# EAGLE schematic NinjaPCB_ver2-180115 (EAGLE 6.6.0)
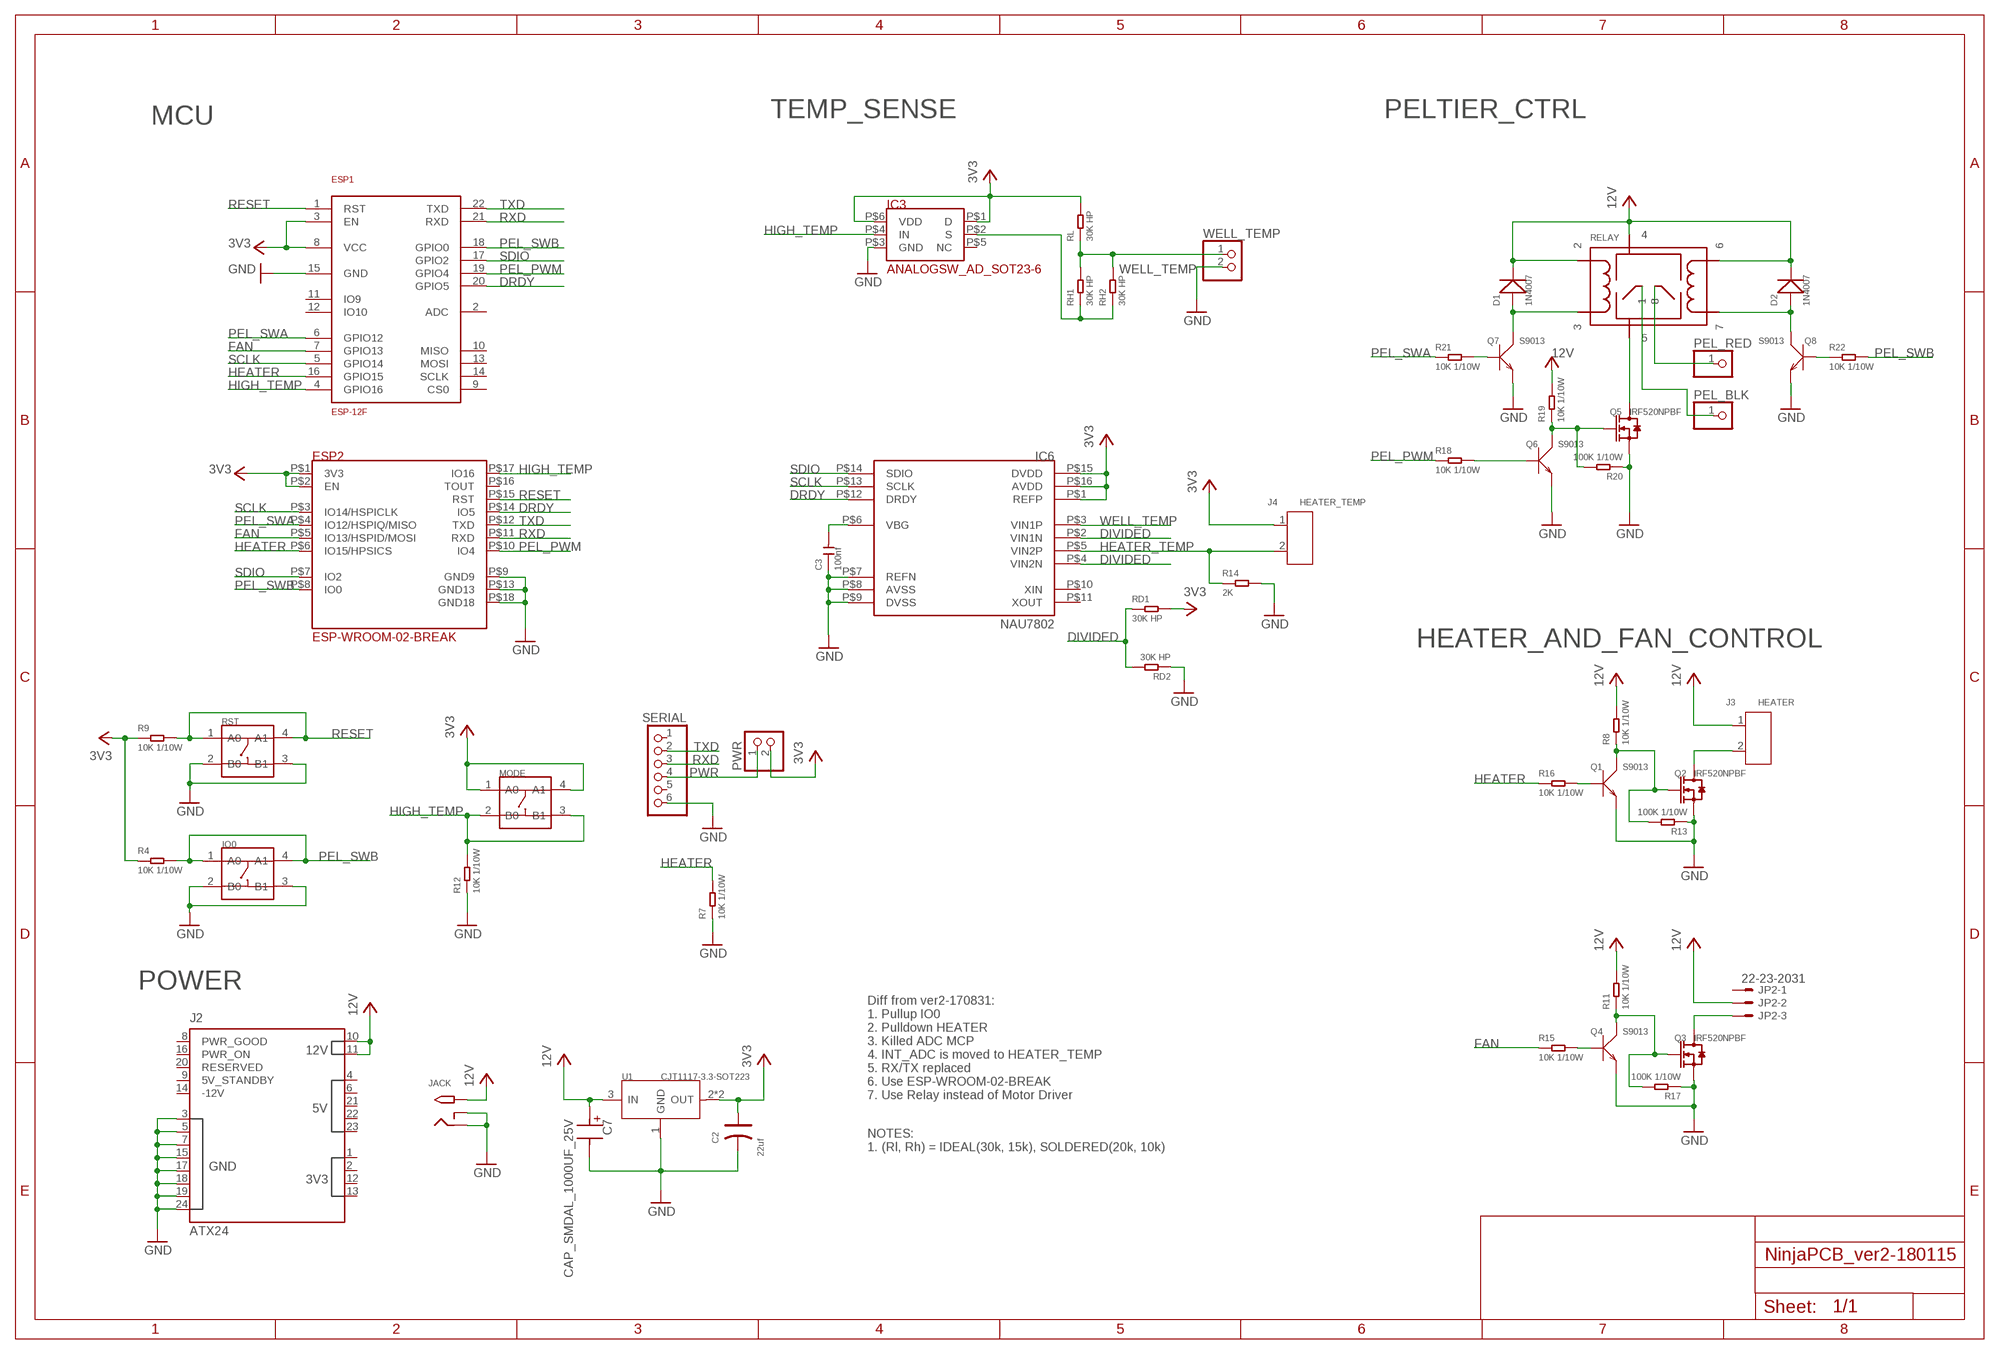
[diagram p0: schematic, sheet 1]

## Parts
C2  22uf  TANTALUM-SMD-22UF-16V(AVX-B)  [AVX-B]
C3  100nf  CERAMIC-100NF-50V-10%-X7R(0603)  [C0603]
C7  CAP_SMDAL_1000UF_25V  [CAP_SMD_AL_D125]
D1  1N4007  DIODE-GEN-PURPOSE-1KV-1A(DO-214AC)  [DO-214AC]
D2  1N4007  DIODE-GEN-PURPOSE-1KV-1A(DO-214AC)  [DO-214AC]
ESP1  ESP-12F  [ESP-12F]
ESP2  ESP-WROOM-02-BREAK  [ESP-WROOM-02-BREAK]
IC3  ANALOGSW_AD_SOT23-6  [SOT-23-6]
IC6  NAU7802  [SOP-16]
IO0  DIP-SWITCH-TACTILE-SPST-NO/TS-1109(4P-D6.0MM)'TS-1109'  [SW4-6.0X6.0X5.0MM]
J2  ATX24  [ATX24]
J3  HEATER  SCREW-TERMINAL-GREEN(2P-3.5)  [H2-3.5-7.0X7.0MM]
J4  HEATER_TEMP  SCREW-TERMINAL-GREEN(2P-3.5)  [H2-3.5-7.0X7.0MM]
JACK  2.1MMJACKTHM  [PJ-102A]
JP2  22-23-2031  [22-23-2031]
MODE  DIP-SWITCH-TACTILE-SPST-NO/TS-1109(4P-D6.0MM)'TS-1109'  [SW4-6.0X6.0X5.0MM]
PEL_BLK  PINHD-1X1L  [1X01LONG]
PEL_RED  PINHD-1X1L  [1X01LONG]
PWR  PINHD-1X2  [1X02]
Q1  S9013  SMD-TRANSISTORS-NPN-25V-500MA-S9013(SOT-23)  [SOT-23]
Q2  IRF520NPBF  DIP-MOSFET-N-CH-100V-9.7A-IRF520NPBF(TO-220AB)CORRECT  [TO-220]
Q3  IRF520NPBF  DIP-MOSFET-N-CH-100V-9.7A-IRF520NPBF(TO-220AB)CORRECT  [TO-220]
Q4  S9013  SMD-TRANSISTORS-NPN-25V-500MA-S9013(SOT-23)  [SOT-23]
Q5  IRF520NPBF  DIP-MOSFET-N-CH-100V-9.7A-IRF520NPBF(TO-220AB)CORRECT  [TO-220]
Q6  S9013  SMD-TRANSISTORS-NPN-25V-500MA-S9013(SOT-23)  [SOT-23]
Q7  S9013  SMD-TRANSISTORS-NPN-25V-500MA-S9013(SOT-23)  [SOT-23]
Q8  S9013  SMD-TRANSISTORS-NPN-25V-500MA-S9013(SOT-23)  [SOT-23]
R4  10K 1/10W  SMD-RES-10K-5%-1/10W(0603)  [R0603]
R7  10K 1/10W  SMD-RES-10K-5%-1/10W(0603)  [R0603]
R8  10K 1/10W  SMD-RES-10K-5%-1/10W(0603)  [R0603]
R9  10K 1/10W  SMD-RES-10K-5%-1/10W(0603)  [R0603]
R11  10K 1/10W  SMD-RES-10K-5%-1/10W(0603)  [R0603]
R12  10K 1/10W  SMD-RES-10K-5%-1/10W(0603)  [R0603]
R13  100K 1/10W  SMD-RES-100K-5%-1/10W(0603)  [R0603]
R14  2K  SMD-RES-2K-1%-1/10W(0603)  [R0603]
R15  10K 1/10W  SMD-RES-10K-5%-1/10W(0603)  [R0603]
R16  10K 1/10W  SMD-RES-10K-5%-1/10W(0603)  [R0603]
R17  100K 1/10W  SMD-RES-100K-5%-1/10W(0603)  [R0603]
R18  10K 1/10W  SMD-RES-10K-5%-1/10W(0603)  [R0603]
R19  10K 1/10W  SMD-RES-10K-5%-1/10W(0603)  [R0603]
R20  100K 1/10W  SMD-RES-100K-5%-1/10W(0603)  [R0603]
R21  10K 1/10W  SMD-RES-10K-5%-1/10W(0603)  [R0603]
R22  10K 1/10W  SMD-RES-10K-5%-1/10W(0603)  [R0603]
RD1  30K HP  R0603  [R0603]
RD2  30K HP  R0603  [R0603]
RELAY  NEC-RELAY2ET2  [NEC-ET2-N8]
RH1  30K HP  R0603  [R0603]
RH2  30K HP  R0603  [R0603]
RL  30K HP  R0603  [R0603]
RST  DIP-SWITCH-TACTILE-SPST-NO/TS-1109(4P-D6.0MM)'TS-1109'  [SW4-6.0X6.0X5.0MM]
SERIAL  PINHD-1X6  [1X06]
U1  CJT1117-3.3-SOT223  PMIC-CJT1117-3.3(SOT223)  [SOT-223]
WELL_TEMP  PINHD-1X2  [1X02]

## Nets
3V3: C2.+ ESP1.3(EN) ESP1.8(VCC) ESP2.P$1(3V3) ESP2.P$2(EN) IC3.P$1(D) IC3.P$6(VDD) IC6.P$1(REFP) IC6.P$15(DVDD) IC6.P$16(AVDD) J4.1 MODE.1(A0) MODE.4(A1) PWR.2 R4.1 R9.1 RD1.2 RL.2 U1.2(OUT) U1.TER(OUT)
12V: C7.P$P D1.2(-) D2.2(-) J2.10(12V_10) J2.11(12V_11) J3.1 JACK.TIP JP2.2 R8.2 R11.2 R19.2 RELAY.P$2 RELAY.P$4 RELAY.P$6 U1.3(IN)
DIVIDED: IC6.P$2(VIN1N) IC6.P$4(VIN2N) RD1.1 RD2.2
DRDY: ESP1.20(GPIO5) ESP2.P$14(IO5) IC6.P$12(DRDY)
FAN: ESP1.7(GPIO13) ESP2.P$5(IO13/HSPID/MOSI) R15.1
GND: C2.- C3.1 C7.P$M ESP1.15(GND) ESP2.P$9(GND9) ESP2.P$13(GND13) ESP2.P$18(GND18) IC3.P$3(GND) IC6.P$7(REFN) IC6.P$8(AVSS) IC6.P$9(DVSS) IO0.2(B0) IO0.3(B1) J2.3(GND3) J2.5(GND5) J2.7(GND7) J2.15(GND15) J2.17(GND17) J2.18(GND18) J2.19(GND19) J2.24(GND24) JACK.RING JACK.RING_SW Q1.2(E) Q2.3(S) Q3.3(S) Q4.2(E) Q5.3(S) Q6.2(E) Q7.2(E) Q8.2(E) R7.1 R12.1 R13.1 R14.2 R17.1 R20.1 RD2.1 RST.2(B0) RST.3(B1) SERIAL.6 U1.1(GND) WELL_TEMP.2
HEATER: ESP1.16(GPIO15) ESP2.P$6(IO15/HPSICS) R7.2 R16.1
HEATER_TEMP: IC6.P$5(VIN2P) J4.2 R14.1
HIGH_TEMP: ESP1.4(GPIO16) ESP2.P$17(IO16) IC3.P$4(IN) MODE.2(B0) MODE.3(B1) R12.2
N$2: J3.2 Q2.2(D) Q2.HEAT(D)
N$3: Q5.2(D) Q5.HEAT(D) RELAY.P$5
N$4: JP2.3 Q3.2(D) Q3.HEAT(D)
N$5: Q5.1(G) Q6.3(C) R19.1 R20.2
N$6: PEL_RED.1 RELAY.P$8
N$7: PEL_BLK.1 RELAY.P$1
N$25: Q3.1(G) Q4.3(C) R11.1 R17.2
N$27: IC3.P$2(S) RH1.1 RH2.1
N$29: Q1.3(C) Q2.1(G) R8.1 R13.2
N$30: Q6.1(B) R18.2
N$31: Q4.1(B) R15.2
N$32: Q1.1(B) R16.2
N$33: D1.1(+) Q7.3(C) RELAY.P$3
N$34: Q7.1(B) R21.2
N$35: Q8.1(B) R22.1
N$36: D2.1(+) Q8.3(C) RELAY.P$7
N$92: C3.2 IC6.P$6(VBG)
PEL_PWM: ESP1.19(GPIO4) ESP2.P$10(IO4) R18.1
PEL_SWA: ESP1.6(GPIO12) ESP2.P$4(IO12/HSPIQ/MISO) R21.1
PEL_SWB: ESP1.18(GPIO0) ESP2.P$8(IO0) IO0.1(A0) IO0.4(A1) R4.2 R22.2
PWR: PWR.1 SERIAL.4
RESET: ESP1.1(RST) ESP2.P$15(RST) R9.2 RST.1(A0) RST.4(A1)
RXD: ESP1.21(RXD) ESP2.P$11(RXD) SERIAL.3
SCLK: ESP1.5(GPIO14) ESP2.P$3(IO14/HSPICLK) IC6.P$13(SCLK)
SDIO: ESP1.17(GPIO2) ESP2.P$7(IO2) IC6.P$14(SDIO)
TXD: ESP1.22(TXD) ESP2.P$12(TXD) SERIAL.2
WELL_TEMP: IC6.P$3(VIN1P) RH1.2 RH2.2 RL.1 WELL_TEMP.1
Unconnected: ESP1.2(ADC) ESP1.9(CS0) ESP1.10(MISO) ESP1.11(IO9) ESP1.12(IO10) ESP1.13(MOSI) ESP1.14(SCLK) ESP2.P$16(TOUT) IC3.P$5(NC) IC6.P$10(XIN) IC6.P$11(XOUT) J2.1(3V3_1) J2.2(3V3_2) J2.4(5V_4) J2.6(5V_6) J2.8(PWR_GOOD) J2.9(5V_STANDBY) J2.12(3V3_12) J2.13(3V3_13) J2.14(-12V) J2.16(PWR_ON) J2.20(RESERVED) J2.21(5V_21) J2.22(5V_22) J2.23(5V_23) JP2.1 SERIAL.1 SERIAL.5

## Notes on the sheet
- MCU | TEMP_SENSE | PELTIER_CTRL
- HEATER_AND_FAN_CONTROL
- POWER
- Diff from ver2-170831: 
  1. Pullup IO0
  2. Pulldown HEATER
  3. Killed ADC MCP
  4. INT_ADC is moved to HEATER_TEMP
  5. RX/TX replaced
  6. Use ESP-WROOM-02-BREAK
  7. Use Relay instead of Motor Driver
- NOTES: 
  1. (Rl, Rh) = IDEAL(30k, 15k), SOLDERED(20k, 10k)

## Library data of the parts
C2 = Seeed-Capacitor:TANTALUM-SMD-22UF-16V(AVX-B): 302020013; MPN: TAJB226*016#NJ
C3 = Seeed-Capacitor:CERAMIC-100NF-50V-10%-X7R(0603): 302010138; MPN: CC0603KRX7R9BB104
C7 = Seeed-OPL-2017-01-Capacitor-akita:CAP_SMDAL_1000UF_25V: SMD CAP Aluminum 1000uF-25V;D12.5*H13.5mm SKU: 302030098
D1 D2 = Seeed-Diode:DIODE-GEN-PURPOSE-1KV-1A(DO-214AC): 304010013; MPN: 1N4007
ESP1 = Seeed-OPL-2017-01-Sensor-camilo:ESP-12F: 317060163
ESP2 = PCR-Module:ESP-WROOM-02-BREAK
IC3 = PCR-IC:ANALOGSW_AD_SOT23-6
IC6 = PCR-IC:NAU7802
IO0 MODE RST = Seeed-Switch:DIP-SWITCH-TACTILE-SPST-NO/TS-1109(4P-D6.0MM): 311020024
J2 = PCR-Connector:ATX24
J3 J4 = Seeed-Connector:SCREW-TERMINAL-GREEN(2P-3.5): 320110028; VALUE: GREEN-2P-3.5
JACK = adafruit:2.1MMJACK: 2.1mm x 5.5mm THM DC jack with internal switch. Digikey part #PJ-102A, 4UCON part #05537 2.1mm x 5.5mm SMT DC jack with internal switch. Digikey part #PJ-002A-SMT, 4UCON part #03267 By microbuilder.eu & adafruit.com
JP2 = con-molex:22-23-2031: .100" (2.54mm) Center Header - 3 Pin; MF: MOLEX; MPN: 22-23-2031; OC_FARNELL: 1462950; OC_NEWARK: 30C0862
PEL_BLK PEL_RED = pinhead:PINHD-1X1: PIN HEADER
PWR WELL_TEMP = pinhead:PINHD-1X2: PIN HEADER
Q1 Q4 Q6-Q8 = Seeed-Transistor:SMD-TRANSISTORS-NPN-25V-500MA-S9013(SOT-23): 305010018; MPN: S9013
Q2 Q3 Q5 = Seeed-Transistor:DIP-MOSFET-N-CH-100V-9.7A-IRF520NPBF(TO-220AB): 305030059
R4 R7-R9 R11 R12 R15 R16 R18 R19 R21 R22 = Seeed-Resistor:SMD-RES-10K-5%-1/10W(0603): 301010293; MPN: RC0603JR-0710KL
R13 R17 R20 = Seeed-Resistor:SMD-RES-100K-5%-1/10W(0603): 301010089; MPN: RC0603JR-07100KL
R14 = Seeed-Resistor:SMD-RES-2K-1%-1/10W(0603): 301010221; MPN: RC0603FR-072KL
RD1 RD2 RH1 RH2 RL = PCR-RCL:R0603
RELAY = PCR-Switch:NEC-RELAY2
SERIAL = pinhead:PINHD-1X6: PIN HEADER
U1 = Seeed-IC:PMIC-CJT1117-3.3(SOT223): 310030097; MPN: CJT1117-3.3

## Net classes
1 2A: width 0.406 mm
2 8A: width 2.54 mm